# Altium schematic sheet 4_Supply - Copy.SchDoc
size A4; DocumentNumber: 3; SheetNumber: 4; SheetTotal: 6
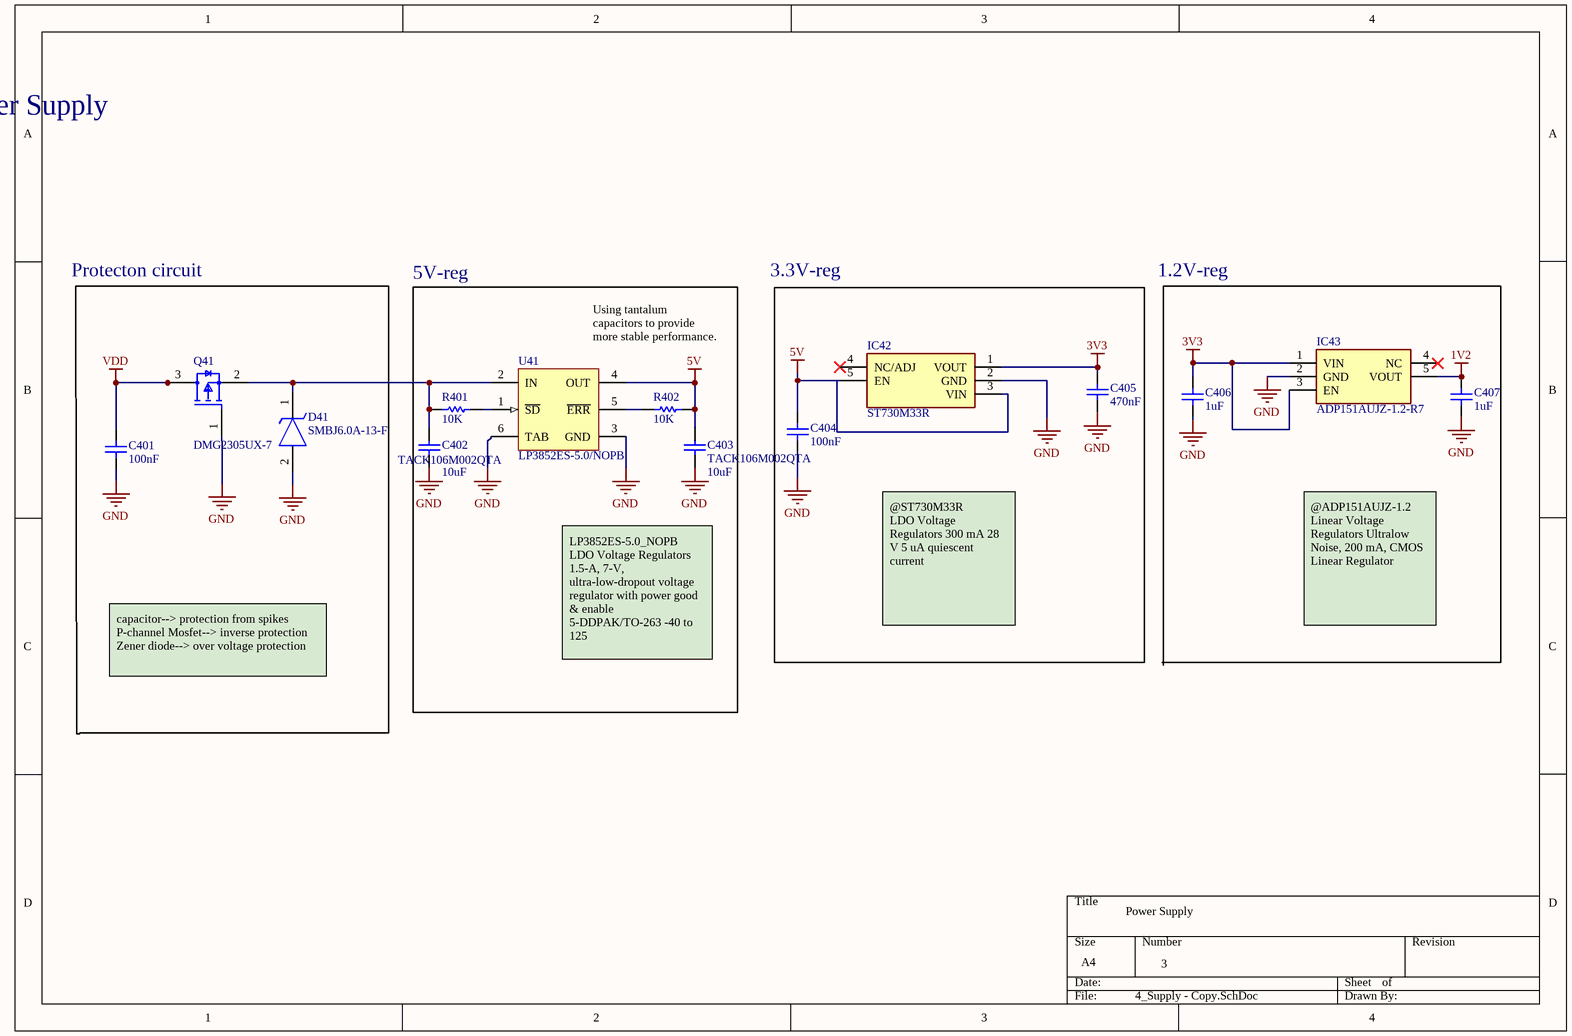
[diagram p0: 4_Supply - Copy.SchDoc]

## Parts
C401  value 100nF  [CAPC1005X55X30LL05T10]  (hidden comment: generic)
C402  TACK106M002QTA  Capacitance Const: 10uF  [CAPC1005X70X10LL20T00]
C403  TACK106M002QTA  Capacitance Const: 10uF  [CAPC1005X70X10LL20T00]
C404  value 100nF  [CAPC1005X55X30LL05T10]  (hidden comment: generic)
C405  value 470nF  [CAPC1005X55X30LL05T10]  (hidden comment: generic)
C406  value 1uF  [CAPC1005X55X30LL05T10]  (hidden comment: generic)
C407  value 1uF  [CAPC1005X55X30LL05T10]  (hidden comment: generic)
D41  SMBJ6.0A-13-F  [SMBJ12A]
IC42  ST730M33R  [SOT95P280X145-5N]
IC43  ADP151AUJZ-1.2-R7  [ADI-UJ-5_L]
Q41  DMG2305UX-7  [FP-SOT23-IPC_B]
R401  10K  [RESC1005X40X25LL10T10]
R402  10K  [RESC1005X40X25LL10T10]
U41  LP3852ES-5.0/NOPB  [KTT0005B_L]

## Blocks framed on the sheet
Protecton circuit: C401 D41 Q41
5V-reg: C402 C403 R401 R402 U41
3.3V-reg: C404 C405 IC42

## Nets
1V2: C407.1 IC43.5(VOUT)
3V3: C405.1 C406.1 IC42.1(VOUT) IC43.1(VIN) IC43.3(EN)
5V: C403.2 C404.1 IC42.3(VIN) IC42.5(EN) R402.1 U41.4(OUT)
GND: C401.2 C402.1 C403.1 C404.2 C405.2 C406.2 C407.2 D41.2(A) IC42.2(GND) IC43.2(GND) Q41.1(GATE) U41.3(GND) U41.6(TAB)
VDD: C401.1 Q41.3(DRAIN)
NetC402_2: C402.2 D41.1(K) Q41.2(SOURCE) R401.2 U41.2(IN)
NetR401_1: R401.1 U41.1(~{SD})
NetR402_2: R402.2 U41.5(~{ERR})

Not connected (* = marked no-connect by the designer): IC42 4(NC/ADJ)*; IC43 4(NC)*

## Notes on the sheet
- [4] 4_EIT_Power Supply
- 1.2V-reg
- (near U41) Using tantalum capacitors to provide more stable performance.
- LP3852ES-5.0_NOPB   LDO Voltage Regulators 1.5-A, 7-V, ultra-low-dropout voltage regulator with power good & enable 5-DDPAK/TO-263 -40 to 125
- @ST730M33R
  LDO Voltage Regulators 300 mA 28 V 5 uA quiescent current
- @ADP151AUJZ-1.2   Linear Voltage Regulators Ultralow Noise, 200 mA, CMOS Linear Regulator
- capacitor--> protection from spikes   P-channel Mosfet--> inverse protection    Zener diode--> over voltage protection
- Power Supply
- 3

## Library data of the parts
C401 C404-C407 = Capacitor: Device Class L1: Passive Components; Device Class L2: Capacitors
C402 C403 = CAP: Manufacturer: AVX Interconnect / Elco; Part Number: TACK106M002QTA
D41 = SMBJ6.0A-13-F: TVS Diode (Uni-directional); Manufacturer_Name: Diodes Incorporated; Datasheet Link: https://www.mouser.com/datasheet/2/115/ds19002-1078141.pdf; Height: 2.5mm; Manufacturer_Part_Number: SMBJ6.0A-13-F; Mouser Part Number: 621-SMBJ6.0A-13-F; Mouser Price/Stock: https://www.mouser.co.uk/ProductDetail/Diodes-Incorporated/SMBJ60A-13-F?qs=gaDBXWSqsDAIOdP0T6ZIBg%3D%3D; Arrow Part Number: SMBJ6.0A-13-F; Arrow Price/Stock: https://www.arrow.com/en/products/smbj6.0a-13-f/diodes-incorporated?region=nac
IC42 = ST730M33R: Integrated Circuit; Manufacturer_Name: STMicroelectronics; Datasheet Link: https://www.mouser.at/datasheet/2/389/st730-1621297.pdf; Height: 1.45mm; Manufacturer_Part_Number: ST730M33R; Mouser Part Number: 511-ST730M33R; Mouser Price/Stock: https://www.mouser.co.uk/ProductDetail/STMicroelectronics/ST730M33R?qs=GedFDFLaBXHUqSNzaYM2bg%3D%3D; Arrow Part Number: ST730M33R; Arrow Price/Stock: https://www.arrow.com/en/products/st730m33r/stmicroelectronics?region=nac
IC43 = ADP151AUJZ-1.2-R7: Integrated Circuit; Manufacturer_Name: Analog Devices; Datasheet Link: https://componentsearchengine.com/Datasheets/2/ADP151AUJZ-1.2-R7.pdf; Height: 1mm; Manufacturer_Part_Number: ADP151AUJZ-1.2-R7; Mouser Part Number: 584-ADP151AUJZ-1.2R7; Mouser Price/Stock: https://www.mouser.co.uk/ProductDetail/Analog-Devices/ADP151AUJZ-1.2-R7?qs=WIvQP4zGanhSFSaaw6omsw%3D%3D; Arrow Part Number: ADP151AUJZ-1.2-R7; Arrow Price/Stock: https://www.arrow.com/en/products/adp151aujz-1.2-r7/analog-devices?region=nac
Q41 = CMP-1693-00002-4: MOSFET P-CH 20V 4.2A SOT23; Turn-On Delay Time: 10.8ns; Turn-Off Delay Time: 79.3ns; Threshold Voltage: -900mV; Rise Time: 13.7ns; Gate to Source Voltage (Vgs): 8V; Rds On Max: 52mR; Element Configuration: Single; Fall Time: 34.7ns; Max Power Dissipation: 1.4W; Drain to Source Resistance: 200mR; Number of Channels: 1; Input Capacitance: 808pF; Lead Free: Lead Free; Number of Pins: 3; Length: 3mm; Continuous Drain Current (ID): 4.2A; Contact Plating: Tin; Mount: Surface Mount; Weight: 0.000282oz; Min Operating Temperature: -55°C; Package Quantity: 3000; Drain to Source Voltage (Vdss): 20V; On-State Resistance: 52MR; Max Operating Temperature: 150°C; Height: 1.1mm; REACH SVHC: No SVHC; Packaging: Tape and Reel; Radiation Hardening: No; Case/Package: SOT-23; Width: 1.4mm
R401 R402 = Resistor: generic; Part Number: RC0402FR-0747KL; Manufacturer: Yageo / Phycomp
U41 = PM-REG-LP3871-SIL6: 1.5A Fast Ultra Low Dropout Linear Regulator, 5-pin TO-263, Pb-Free; Manufacturer: Texas Instruments; PackageTopMarking: NSUZXYTTE#*LP3852ES*-5.0; PowerWise: N; CompType: LDO IC; ComponentLink1Description: Datasheet URL; PackageDescription: TO-263, Molded, .400 x .390 x .180in, 5 Lead, .067in Pitch, Surface Mount; ComponentLink1URL: http://www.ti.com/general/docs/lit/getliterature.tsp?genericPartNumber=LP3852&fileType=pdf; PinCount: 5; PackageReference: KTT0005B; Code_JEDEC: MO-169-AB; RoHS: Y